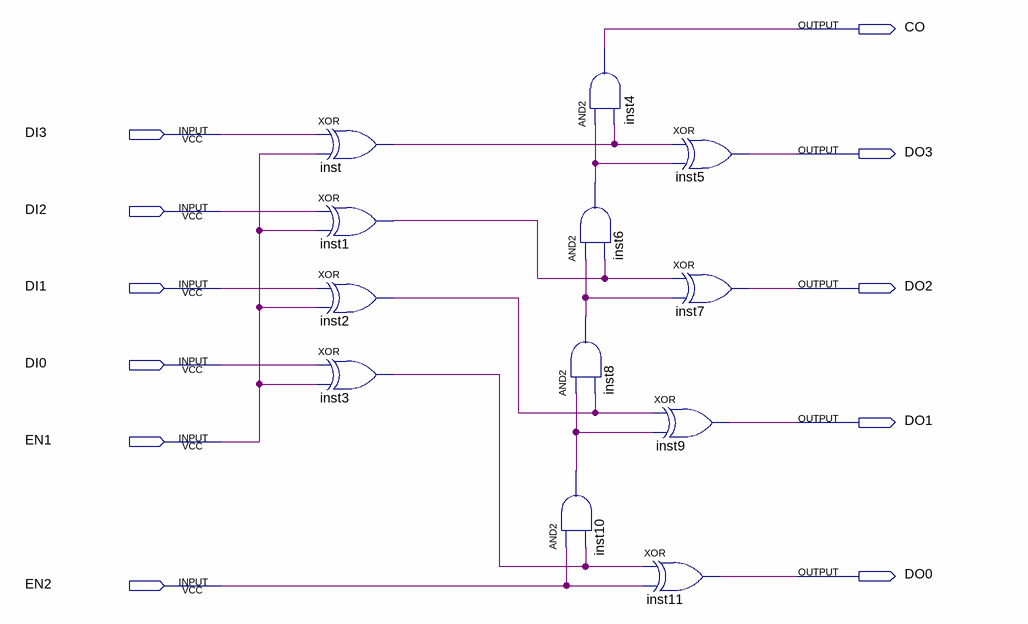
[diagram p0: schematic sheet]
// Quartus schematic Krets_12.bdf as structural Verilog: 12 symbols, 11 pins
module Krets_12 (
  input  DI3,
  input  DI2,
  input  DI1,
  input  DI0,
  input  EN1,
  input  EN2,
  output CO,
  output DO3,
  output DO2,
  output DO1,
  output DO0
);

  wire inst1_out, inst2_out, inst3_out, inst6_out, inst8_out, inst10_out, inst_out;

  xor inst (inst_out, DI3, EN1);
  xor inst1 (inst1_out, DI2, EN1);
  xor inst2 (inst2_out, DI1, EN1);
  xor inst3 (inst3_out, DI0, EN1);
  and inst10 (inst10_out, EN2, inst3_out);
  and inst4 (CO, inst6_out, inst_out);
  and inst6 (inst6_out, inst8_out, inst1_out);
  and inst8 (inst8_out, inst10_out, inst2_out);
  xor inst5 (DO3, inst_out, inst6_out);
  xor inst7 (DO2, inst1_out, inst8_out);
  xor inst9 (DO1, inst2_out, inst10_out);
  xor inst11 (DO0, inst3_out, EN2);
endmodule
